# EAGLE design main (EAGLE 7.2.0)
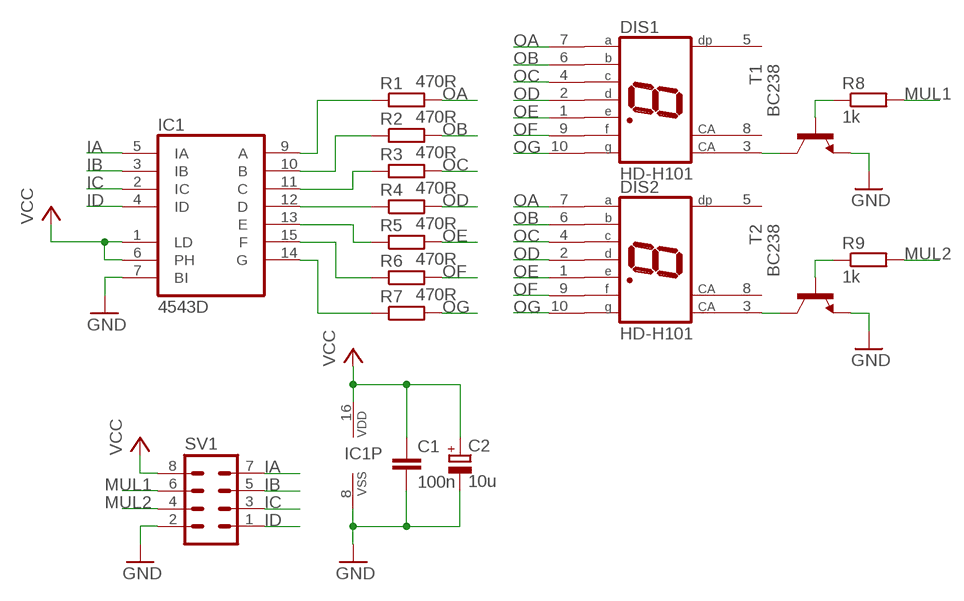
[diagram p0: schematic, sheet 1]

## Parts
C1  100n  C-EUC1206  [C1206]
C2  10u  CPOL-EUSMCA  [SMC_A]
DIS1  HD-H101  [HDSP-M]
DIS2  HD-H101  [HDSP-M]
IC1  4543D  [SO16]
R1  470R  R-EU_R1206  [R1206]
R2  470R  R-EU_R1206  [R1206]
R3  470R  R-EU_R1206  [R1206]
R4  470R  R-EU_R1206  [R1206]
R5  470R  R-EU_R1206  [R1206]
R6  470R  R-EU_R1206  [R1206]
R7  470R  R-EU_R1206  [R1206]
R8  1k  R-EU_R1206  [R1206]
R9  1k  R-EU_R1206  [R1206]
SV1  MA04-2  [MA04-2]
T1  BC238  [TO92]
T2  BC238  [TO92]

## Nets
GND: C1.2 C2.- IC1.7(BI) IC1.8(VSS) SV1.2 T1.1(E) T2.1(E)
IA: IC1.5(IA) SV1.7
IB: IC1.3(IB) SV1.5
IC: IC1.2(IC) SV1.3
ID: IC1.4(ID) SV1.1
MUL1: R8.2 SV1.6
MUL2: R9.2 SV1.4
N$1: IC1.12(D) R4.1
N$2: IC1.11(C) R3.1
N$3: IC1.10(B) R2.1
N$4: IC1.13(E) R5.1
N$5: DIS1.3(CA) T1.3(C)
N$6: R8.1 T1.2(B)
N$8: IC1.15(F) R6.1
N$9: IC1.9(A) R1.1
N$10: IC1.14(G) R7.1
N$11: R9.1 T2.2(B)
N$14: DIS2.3(CA) T2.3(C)
OA: DIS1.7(A) DIS2.7(A) R1.2
OB: DIS1.6(B) DIS2.6(B) R2.2
OC: DIS1.4(C) DIS2.4(C) R3.2
OD: DIS1.2(D) DIS2.2(D) R4.2
OE: DIS1.1(E) DIS2.1(E) R5.2
OF: DIS1.9(F) DIS2.9(F) R6.2
OG: DIS1.10(G) DIS2.10(G) R7.2
VCC: C1.1 C2.+ IC1.1(LD) IC1.6(PH) IC1.16(VDD) SV1.8
Unconnected: DIS1.5(DP) DIS1.8(CA) DIS2.5(DP) DIS2.8(CA)

## Library data of the parts
C1 = resistor:C-EU: CAPACITOR, European symbol
C2 = resistor:CPOL-EU: POLARIZED CAPACITOR, European symbol
DIS1 DIS2 = display-hp:HD-H101: LED DISPLAY 1-character 7 segment, decimal point right; OC_FARNELL: unknown; OC_NEWARK: unknown
IC1 = 45xx:4543: BCD to 7-segment LCD DECODER
R1-R9 = resistor:R-EU_: RESISTOR, European symbol
SV1 = con-lstb:MA04-2: PIN HEADER; OC_FARNELL: unknown; OC_NEWARK: unknown
T1 T2 = transistor:BC238: NPN TRANSISTOR

## Board
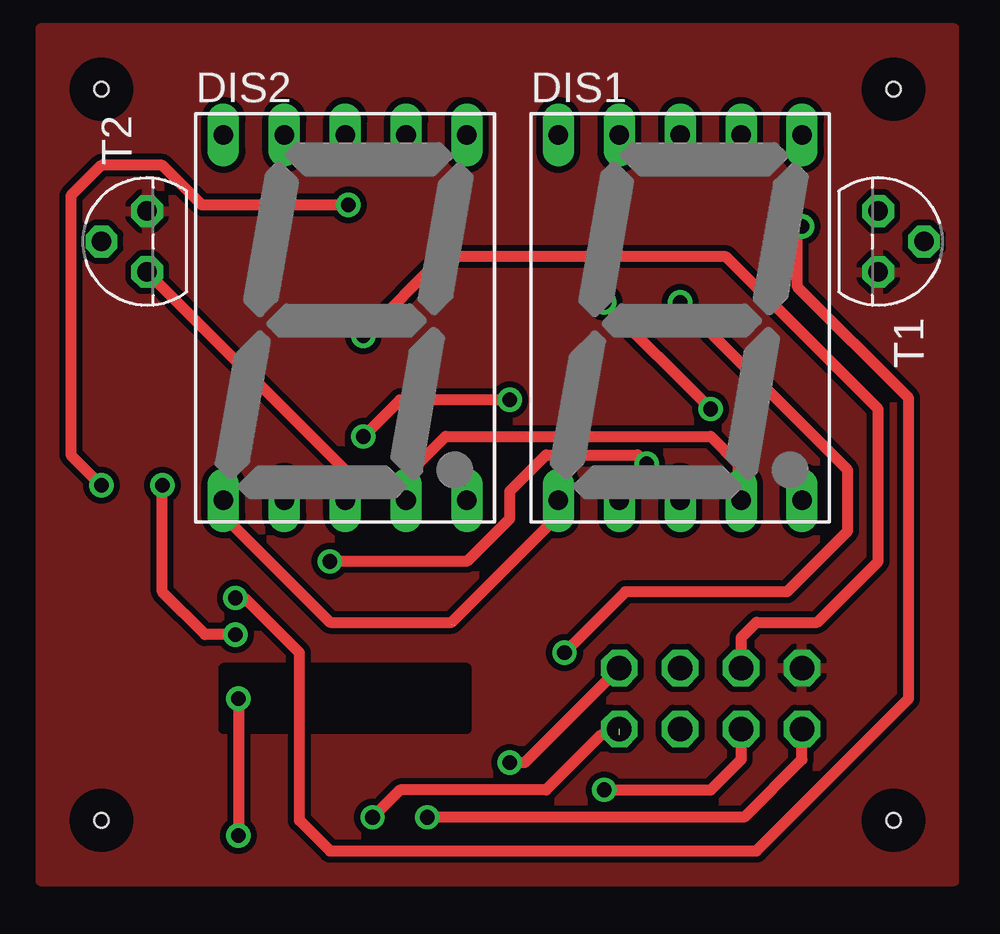
[diagram p1: board, top side]
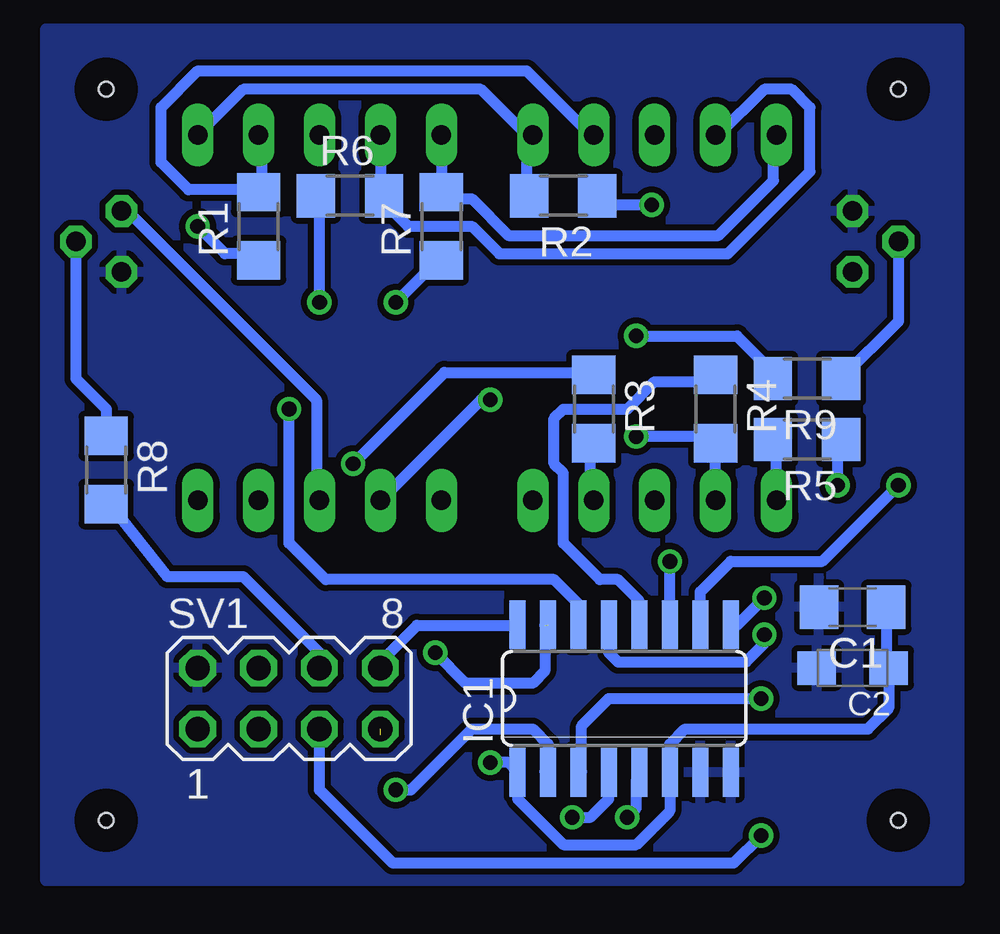
[diagram p2: board, bottom side, seen from below]

No outline drawn. Coordinates in mm, seen from the top.
Copper layers (1*16): Top 0.035mm / dielectric 1.5mm / Bottom 0.035mm
Design rules "default *": minimum track width 18mil, minimum drill 24mil, track to track 10mil, track to pad 10mil, pad to pad 12mil, via to via 8mil, smd to smd 8mil, copper to edge 40mil, drill to drill 8mil, minimum pad ring 10mil, minimum via ring 8mil, stop-mask expansion 4mil, vias tented up to drill 0mil, thermal gap 10mil
Holes 0.6 mm at 2.54,33.02 35.56,33.02 35.56,2.54 2.54,2.54
tRestrict: area 7.6,6.3 to 17.8,8.9

### Footprints (pad centres in the part's own frame; a part is rotated, then mirrored left to right if it is on the bottom)
C1206 = smd 1.6 x 1.8: 1 -1.4,0; 2 1.4,0
SMC_A = smd 1.6 x 1.4: + -1.5,0; - 1.5,0
HDSP-M = drill 0.813 long: 1 -5.08,-7.62; 2 -2.54,-7.62; 3 0,-7.62; 4 2.54,-7.62; 5 5.08,-7.62; 6 5.08,7.62; 7 2.54,7.62; 8 0,7.62; 9 -2.54,7.62; 10 -5.08,7.62
SO16 = smd 0.66 x 2.032: 1 -4.445,-3.073; 2 -3.175,-3.073; 3 -1.905,-3.073; 4 -0.635,-3.073; 5 0.635,-3.073; 6 1.905,-3.073; 7 3.175,-3.073; 8 4.445,-3.073; 9 4.445,3.073; 10 3.175,3.073; 11 1.905,3.073; 12 0.635,3.073; 13 -0.635,3.073; 14 -1.905,3.073; 15 -3.175,3.073; 16 -4.445,3.073
R1206 = smd 1.6 x 1.803: 1 -1.422,0; 2 1.422,0
MA04-2 = drill 1.016 octagon: 1 -3.81,-1.27; 2 -3.81,1.27; 3 -1.27,-1.27; 4 -1.27,1.27; 5 1.27,-1.27; 6 1.27,1.27; 7 3.81,-1.27; 8 3.81,1.27
TO92 = drill 0.813 octagon: 1 1.27,0; 2 0,1.905; 3 -1.27,0

### Placement (x,y rotation side)
C1  4.45,11.43 180 bottom
C2  4.45,8.89 180 bottom
DIS1  26.67,23.5 0 top
DIS2  12.7,23.5 0 top
IC1  13.97,7.62 0 bottom
R1  29.21,27.3 90 bottom
R2  16.51,28.57 180 bottom
R3  15.24,19.68 270 bottom
R4  10.16,19.68 270 bottom
R5  6.35,18.41 180 bottom
R6  25.4,28.57 0 bottom
R7  21.59,27.3 90 bottom
R8  35.56,17.14 270 bottom
R9  6.35,20.95 180 bottom
SV1  27.94,7.62 0 bottom
T1  34.92,26.67 270 top
T2  4.45,26.67 90 top

### Tracks (layer width: path | path; a pad name or v marks a point on that pad's centre or on a via)
GND
  pour Bottom: 0,0 38.1,0 38.1,35.56 0,35.56
  pour Top: 38.1,0 38.1,35.56 0,35.56 0,0
IA  (via drill 0.61)  (1 unrouted)
  Top 0.457: 24.13,6.1 23.37,6.1 21.08,3.81 14.99,3.81 v13.84,2.67
  Bottom 0.457: v13.84,2.67 13.46,3.05 13.46,4.19 IC1.5
IB  (via drill 0.61)
  Top 0.457: v8.26,7.62 v8.26,1.91
  Bottom 0.457: IC1.3 15.75,4.57 15.75,6.48 14.61,7.62 v8.26,7.62 | v8.26,1.91 9.4,0.76 23.62,0.76 26.67,3.81 SV1.5
IC  (via drill 0.61)
  Top 0.457: SV1.3 29.21,5.08 27.94,3.81 v23.5,3.81
  Bottom 0.457: 17.27,4.57 IC1.2 17.14,5.71 17.78,6.35 20.32,6.35 22.86,3.81 v23.5,3.81
ID  (via drill 0.61)
  Top 0.457: v16.13,2.67 29.34,2.67 31.75,5.08 SV1.1
  Bottom 0.457: IC1.4 14.61,3.43 15.37,2.67 v16.13,2.67
MUL1
  Bottom 0.457: R8.2 35.41,15.72 33.02,12.7 29.84,12.7 26.67,9.53 SV1.6
MUL2  (via drill 0.61)
  Top 0.457: SV1.4 29.21,10.16 29.84,10.79 32.38,10.79 34.92,13.34 34.92,19.68 28.57,26.04 16.76,26.04 v13.46,22.73
  Bottom 0.457: v13.46,22.73 9.27,22.73 8.13,21.59 8.13,21.21 R9.2
N$1
  Bottom 0.457: R4.1 10.41,20.83 12.7,20.83 13.84,19.68 16.51,19.68 16.89,19.3 16.89,17.4 16.51,17.02 16.51,14.1 14.99,12.57 14.22,12.57 13.34,11.68 IC1.12
N$2  (via drill 0.61)
  Top 0.457: v25.27,17.4 24.89,17.78 21.08,17.78 19.56,16.26 19.56,15.11 17.78,13.34 v12.06,13.34
  Bottom 0.457: v25.27,17.4 21.46,21.21 15.37,21.21 R3.1 | IC1.11 v12.06,13.34
N$3  (via drill 0.61)
  Top 0.457: v12.83,28.19 6.73,28.19 5.08,29.84 2.54,29.84 1.27,28.57 1.27,17.78 v2.54,16.51
  Bottom 0.457: 14.99,28.83 R2.1 14.71,28.19 v12.83,28.19 | IC1.10 10.79,12.06 9.53,13.34 5.71,13.34 v2.54,16.51
N$4  (via drill 0.61)
  Top 0.457: v8.13,10.29 6.86,10.29 5.08,12.06 v5.08,16.51
  Bottom 0.457: v8.13,10.29 8.13,9.91 8.89,9.14 14.22,9.14 14.61,9.53 IC1.13 | R5.1 5.08,18.16 v5.08,16.51
N$5
  Bottom 0.457: DIS1.3 26.8,15.88 26.8,20.07 34.8,28.07 T1.3
N$6
  Bottom 0.457: T1.2 36.83,20.95 35.56,19.68 R8.1
N$8  (via drill 0.61)  (1 unrouted)
  Top 0.457: v21.84,9.53 24.38,12.06 31.11,12.06 33.66,14.61 33.66,17.14 v26.67,24.13
  Bottom 0.457: v26.67,24.13 26.67,28.42 R6.1 | 17.27,10.67 17.27,8.76 17.78,8.26 20.57,8.26 v21.84,9.53
N$9  (via drill 0.61)
  Top 0.457: v31.75,27.3 31.56,27.12 31.56,24.78 36.2,20.14 36.2,7.62 29.84,1.27 12.06,1.27 10.79,2.54 10.79,9.53 8.51,11.81 v8.13,11.81
  Bottom 0.457: v8.13,11.81 9.27,10.67 IC1.9 | R1.1 29.46,26.16 30.61,26.16 v31.75,27.3
N$10  (via drill 0.61)
  Top 0.457: v27.94,19.68 v23.5,24.13
  Bottom 0.457: v27.94,19.68 27.94,14.1 26.42,12.57 16.89,12.57 15.88,11.56 IC1.14 | 21.84,25.78 R7.1 21.59,25.4 22.23,25.4 v23.5,24.13
N$11
  Bottom 0.457: 4.7,21.21 R9.1 2.54,23.34 T2.2
N$14
  Top 0.457: DIS2.3 12.7,17.14 T2.3
OA
  Bottom 0.457: DIS1.7 29.08,31.11 29.08,28.83 R1.2 29.46,28.83 32.13,28.83 33.27,29.97 33.27,32.26 31.75,33.78 18.03,33.78 15.37,31.11 DIS2.7
OB
  Bottom 0.457: 18.03,31.11 18.03,28.83 R2.2 | DIS1.6 29.84,33.02 19.94,33.02 18.03,31.11 | 18.03,31.11 DIS2.6
OC
  Top 0.457: DIS1.4 29.08,15.88 29.08,17.4 27.94,18.54 16.89,18.54 15.37,17.02 15.37,15.88 DIS2.4
  Bottom 0.457: R3.2 15.37,18.16 15.37,15.88 DIS2.4
OD  (via drill 0.61)
  Top 0.457: v19.56,20.07 14.99,20.07 v13.46,18.54
  Bottom 0.457: 10.03,18.16 R4.2 | DIS1.2 19.94,20.07 v19.56,20.07 | v13.46,18.54 10.41,18.54 R4.2 | DIS2.2 R4.2
OE
  Top 0.457: DIS2.1 7.62,15.24 12.06,10.79 17.14,10.79 21.59,15.24 DIS1.1
  Bottom 0.457: DIS2.1 7.62,18.26 R5.2
OF
  Bottom 0.457: DIS2.9 10.03,31.11 8.13,33.02 6.99,33.02 6.22,32.26 6.22,29.59 9.65,26.16 19.18,26.16 20.32,27.3 22.99,27.3 24.13,28.45 R6.2 24.13,28.73 DIS1.9
OG
  Bottom 0.457: 21.46,28.83 R7.2 | R7.2 21.46,28.45 20.32,28.45 18.8,26.92 10.03,26.92 7.75,29.21 7.75,31.11 DIS2.10 | DIS1.10 R7.2
VCC  (via drill 0.61)
  Top 0.457: v19.56,4.95 20.19,4.95 SV1.8
  Bottom 0.457: IC1.16 18.41,10.67 22.61,10.67 24.13,9.14 SV1.8 | v19.56,4.95 18.8,4.95 18.41,4.57 IC1.1 18.41,3.43 16.51,1.52 13.46,1.52 12.06,2.92 IC1.6 12.06,5.71 11.43,6.35 3.81,6.35 2.94,7.21 C2.+ 3.04,8.99 C1.1